# EAGLE design USB-RS232 Adapter (EAGLE 4.14)
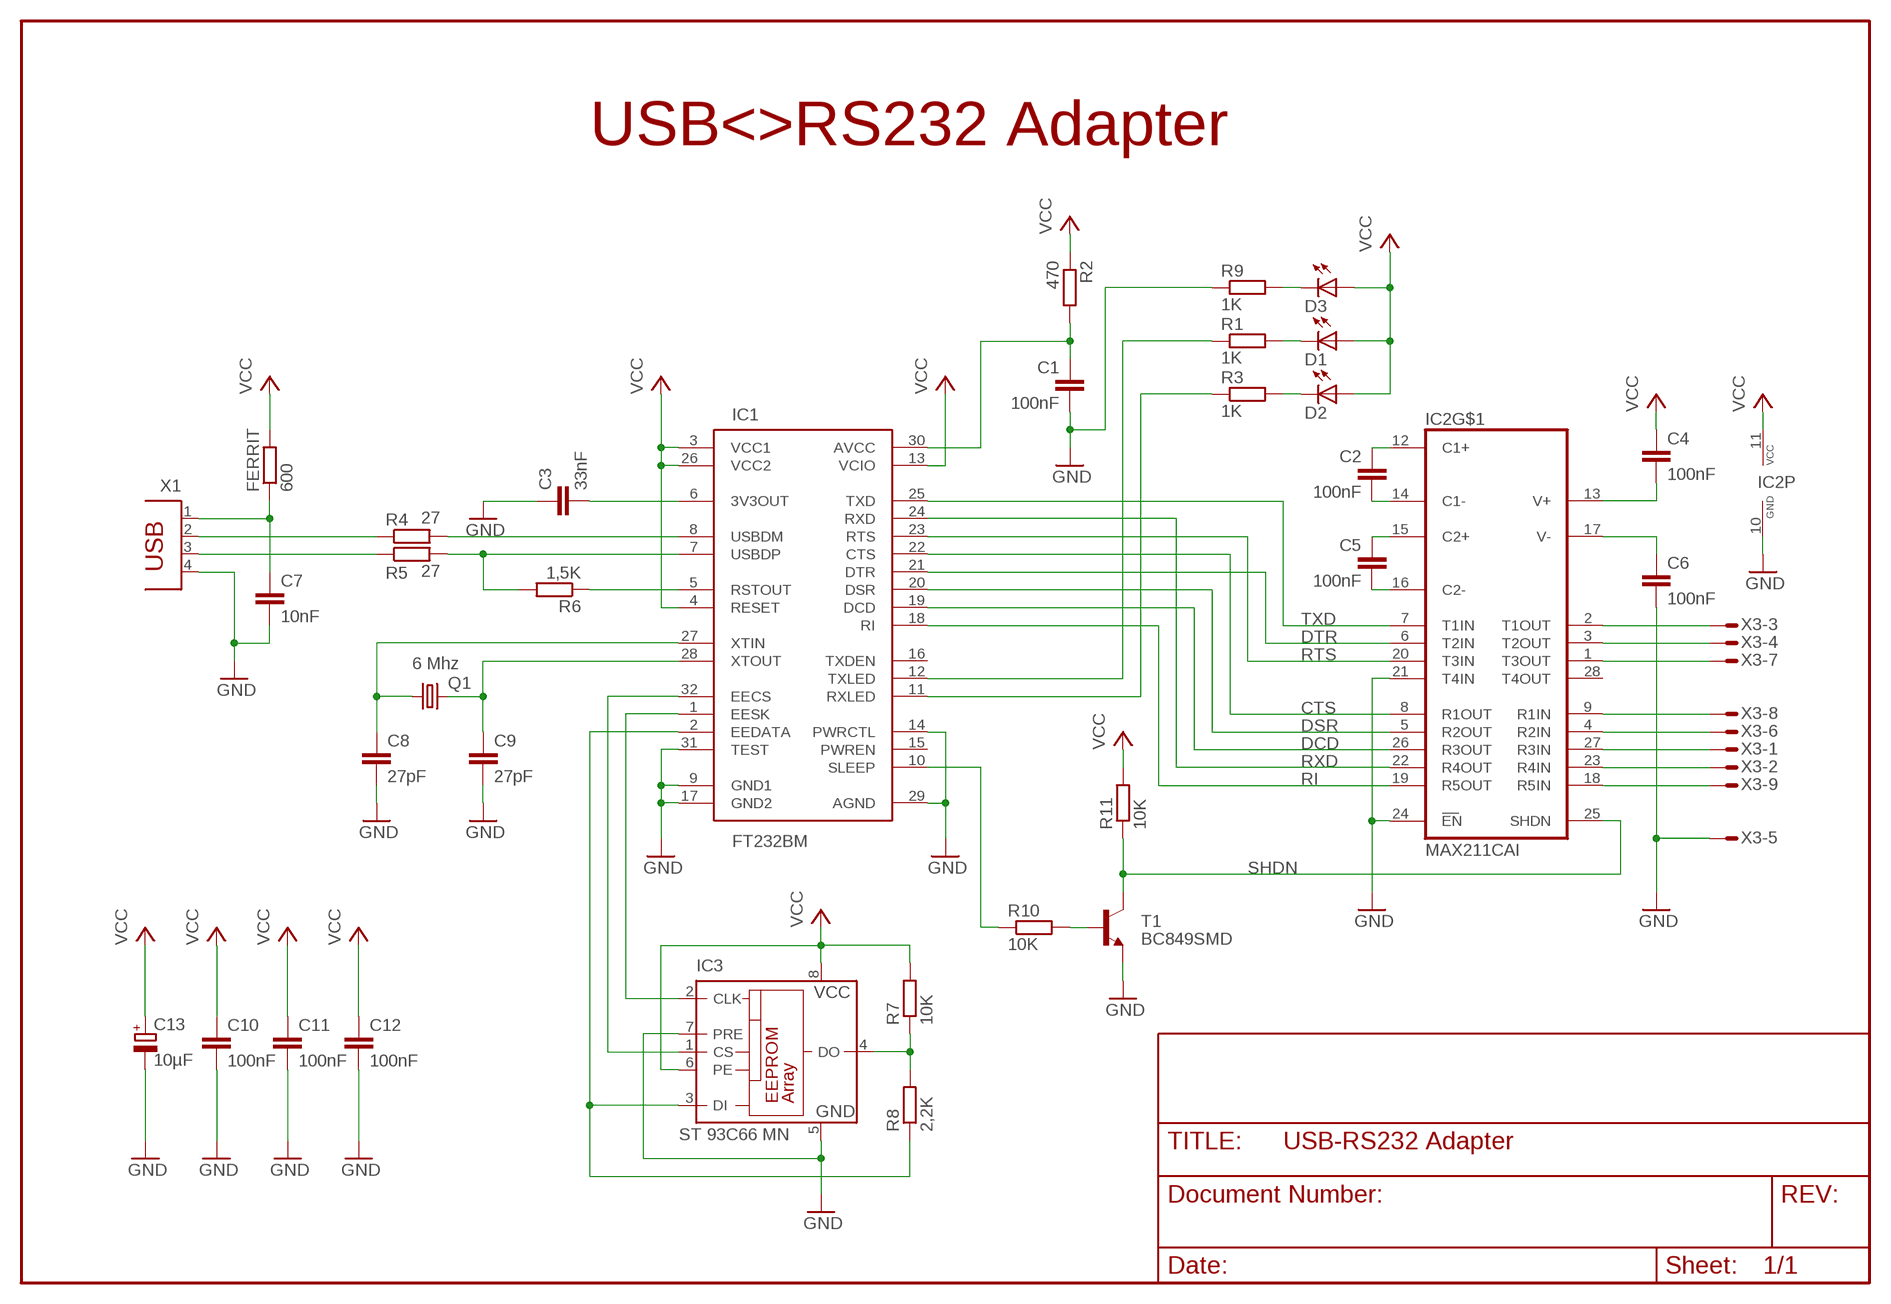
[diagram p0: schematic, sheet 1]

## Parts
C1  100nF  C-EUC1206  [C1206]
C2  100nF  C-EUC1206  [C1206]
C3  33nF  C-EUC1206  [C1206]
C4  100nF  C-EUC1206  [C1206]
C5  100nF  C-EUC1206  [C1206]
C6  100nF  C-EUC1206  [C1206]
C7  10nF  C-EUC1206  [C1206]
C8  27pF  C-EUC1206  [C1206]
C9  27pF  C-EUC1206  [C1206]
C10  100nF  C-EUC1206  [C1206]
C11  100nF  C-EUC1206  [C1206]
C12  100nF  C-EUC1206  [C1206]
C13  10µF  CPOL-EUB  [PANASONIC_B]
D1  LED3MM  [LED3MM]
D2  LED3MM  [LED3MM]
D3  LED3MM  [LED3MM]
FERRIT  600  R-EU_R0805  [R0805]
IC1  FT232BM  [QFP-32]
IC2  MAX211CAI  [SSOP28]
IC3  ST 93C66 MN  93LCS56SN  [SO-08]
Q1  6 Mhz  CRYTALHC49U-V  [HC49U-V]
R1  1K  R-EU_R1206  [R1206]
R2  470  R-EU_R1206  [R1206]
R3  1K  R-EU_R1206  [R1206]
R4  27  R-EU_M1206  [M1206]
R5  27  R-EU_M1206  [M1206]
R6  1,5K  R-EU_R1206  [R1206]
R7  10K  R-EU_R1206  [R1206]
R8  2,2K  R-EU_R1206  [R1206]
R9  1K  R-EU_R1206  [R1206]
R10  10K  R-EU_M1206  [M1206]
R11  10K  R-EU_M1206  [M1206]
T1  BC849SMD  [SOT23-BEC]
X1  PN61729  [PN61729]
X3  M09HPS  [M09HP]

## Nets
_RXD: IC2.23(R4IN) X3.2
_TXD: IC2.2(T1OUT) X3.3
CTS: IC1.22(CTS) IC2.8(R1OUT)
DCD: IC1.19(DCD) IC2.26(R3OUT)
DSR: IC1.20(DSR) IC2.5(R2OUT)
DTR: IC1.21(DTR) IC2.6(T2IN)
EECS: IC1.32(EECS) IC3.1(CS)
EEDATA: IC1.2(EEDATA) IC3.3(DI) R8.1
EESK: IC1.1(EESK) IC3.2(CLK)
GND: C1.2 C3.1 C6.2 C7.2 C8.2 C9.2 C10.2 C11.2 C12.2 C13.- IC1.9(GND1) IC1.14(PWRCTL) IC1.17(GND2) IC1.29(AGND) IC1.31(TEST) IC2.10(P:GND) IC2.21(T4IN) IC2.24(EN) IC3.5(GND) IC3.7(PRE) R9.1 T1.E X1.4 X3.5
N$1: C7.1 FERRIT.1 X1.1
N$3: R4.1 X1.2
N$4: R5.1 X1.3
N$5: IC1.8(USBDM) R4.2
N$6: IC1.7(USBDP) R5.2 R6.2
N$7: IC1.5(RSTOUT) R6.1
N$8: C3.2 IC1.6(3V3OUT)
N$9: C1.1 IC1.30(AVCC) R2.2
N$10: C8.1 IC1.27(XTIN) Q1.1
N$11: IC2.3(T2OUT) X3.4
N$12: D3.K(C) R9.2
N$13: R10.2 T1.B
N$21: IC2.1(T3OUT) X3.7
N$22: IC2.9(R1IN) X3.8
N$23: IC2.4(R2IN) X3.6
N$24: IC2.27(R3IN) X3.1
N$26: IC2.18(R5IN) X3.9
N$27: C4.2 IC2.13(V+)
N$28: C6.1 IC2.17(V-)
N$29: C9.1 IC1.28(XTOUT) Q1.2
N$30: D1.K(C) R1.2
N$31: C2.2 IC2.14(C1-)
N$32: C5.2 IC2.16(C2-)
N$33: C5.1 IC2.15(C2+)
N$34: C2.1 IC2.12(C1+)
N$35: IC3.4(DO) R7.1 R8.2
N$36: D2.K(C) R3.2
RI: IC1.18(RI) IC2.19(R5OUT)
RTS: IC1.23(RTS) IC2.20(T3IN)
RXD: IC1.24(RXD) IC2.22(R4OUT)
RXLED: IC1.11(RXLED) R3.1
SHDN: IC2.25(SHDN) R11.1 T1.C
SLEEP: IC1.10(SLEEP) R10.1
TXD: IC1.25(TXD) IC2.7(T1IN)
TXLED: IC1.12(TXLED) R1.1
VCC: C4.1 C10.1 C11.1 C12.1 C13.+ D1.A D2.A D3.A FERRIT.2 IC1.3(VCC1) IC1.4(RESET) IC1.13(VCIO) IC1.26(VCC2) IC2.11(P:VCC) IC3.6(PE) IC3.8(VCC) R2.1 R7.2 R11.2
Unconnected: IC1.15(PWREN) IC1.16(TXDEN) IC2.28(T4OUT)

## Notes on the sheet
- USB<>RS232 Adapter

## Library data of the parts
C1-C12 = rcl:C-EU: CAPACITOR, European symbol
C13 = rcl:CPOL-EU: POLARIZED CAPACITOR, European symbol
D1-D3 = led:LED: LED OSRAM: - CHIPLED LG R971, LG N971, LY N971, LG Q971, LY Q971, LO R971, LY R971 LH N974, LH R974 LS Q976, LO Q976, LY Q976 LO Q996 - Hyper CHIPLED LW Q18S LB Q993, LB Q99A, LB R99A - SideLED LS A670, LO A670, LY A670, LG A670, LP A670 LB A673, LV A673, LT A673, LW A673 LH A674 LY A675 LS A676, LA A676, LO A676, LY A676, LW A676 LS A679, LY A679, LG A679 - Hyper Micro SIDELED® LS Y876, LA Y876, LO Y876, LY Y876 LT Y87S - SmartLED LW L88C, LW L88S LB L89C, LB L89S, LG L890 LS L89K, LO L89K, LY L89K LS L896, LA L896, LO L896, LY L896 - TOPLED LS T670, LO T670, LY T670, LG T670, LP T670 LSG T670, LSP T670, LSY T670, LOP T670, LYG T670 LG T671, LOG T671, LSG T671 LB T673, LV T673, LT T673, LW T673 LH T674 LS T676, LA T676, LO T676, LY T676, LB T676, LH T676, LSB T676, LW T676 LB T67C, LV T67C, LT T67C, LS T67K, LO T67K, LY T67K, LW E67C LS E67B, LA E67B, LO E67B, LY E67B, LB E67C, LV E67C, LT E67C LW T67C LS T679, LY T679, LG T679 LS T770, LO T770, LY T770, LG T770, LP T770 LB T773, LV T773, LT T773, LW T773 LH T774 LS E675, LA E675, LY E675, LS T675 LS T776, LA T776, LO T776, LY T776, LB T776 LHGB T686 LT T68C, LB T68C - Hyper Mini TOPLED® LB M676 - Mini TOPLED Santana® LG M470 LS M47K, LO M47K, LY M47K Source: http://www.osram.convergy.de/
FERRIT R1-R11 = rcl:R-EU_: RESISTOR, European symbol
IC1 = ftdi:FT232BM: FT232BM USB-RS232 Wandler FTDI
IC2 = maxim:MAX211: RS232 Transciever 0.1 µF externe Kondensatoren
IC3 = microchip:93LCS*: EEPROM 2 K/4 K, 2.5 V Microwire with software write protect
Q1 = crystal:CRYTAL: CRYSTAL
T1 = transistor-npn:BC849*: NPN Transistor
X1 = con-berg:PN61729: BERG
X3 = con-subd:M09?S: SUB-D

## Board
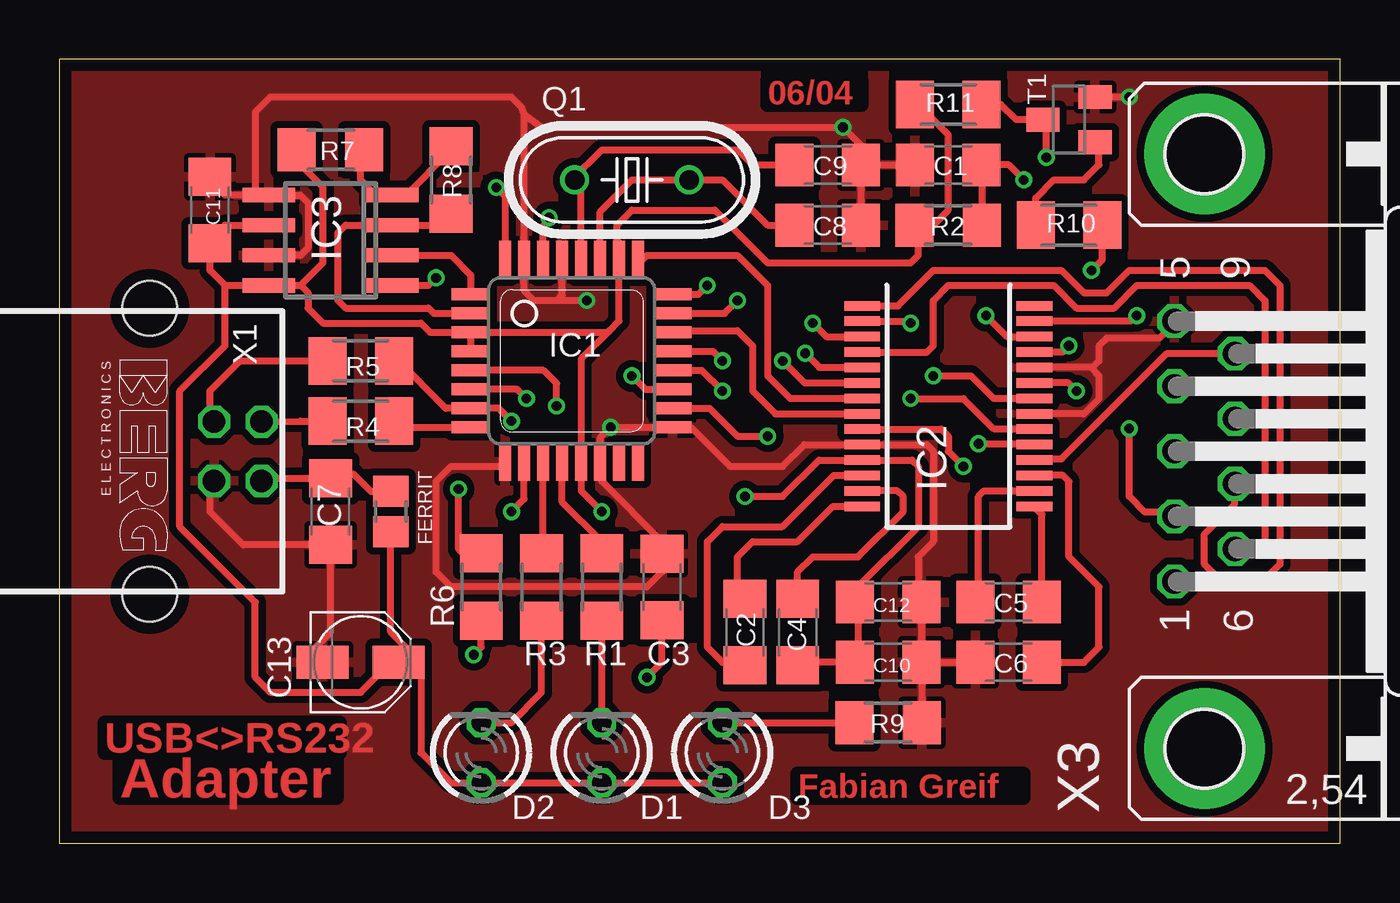
[diagram p1: board, top side]
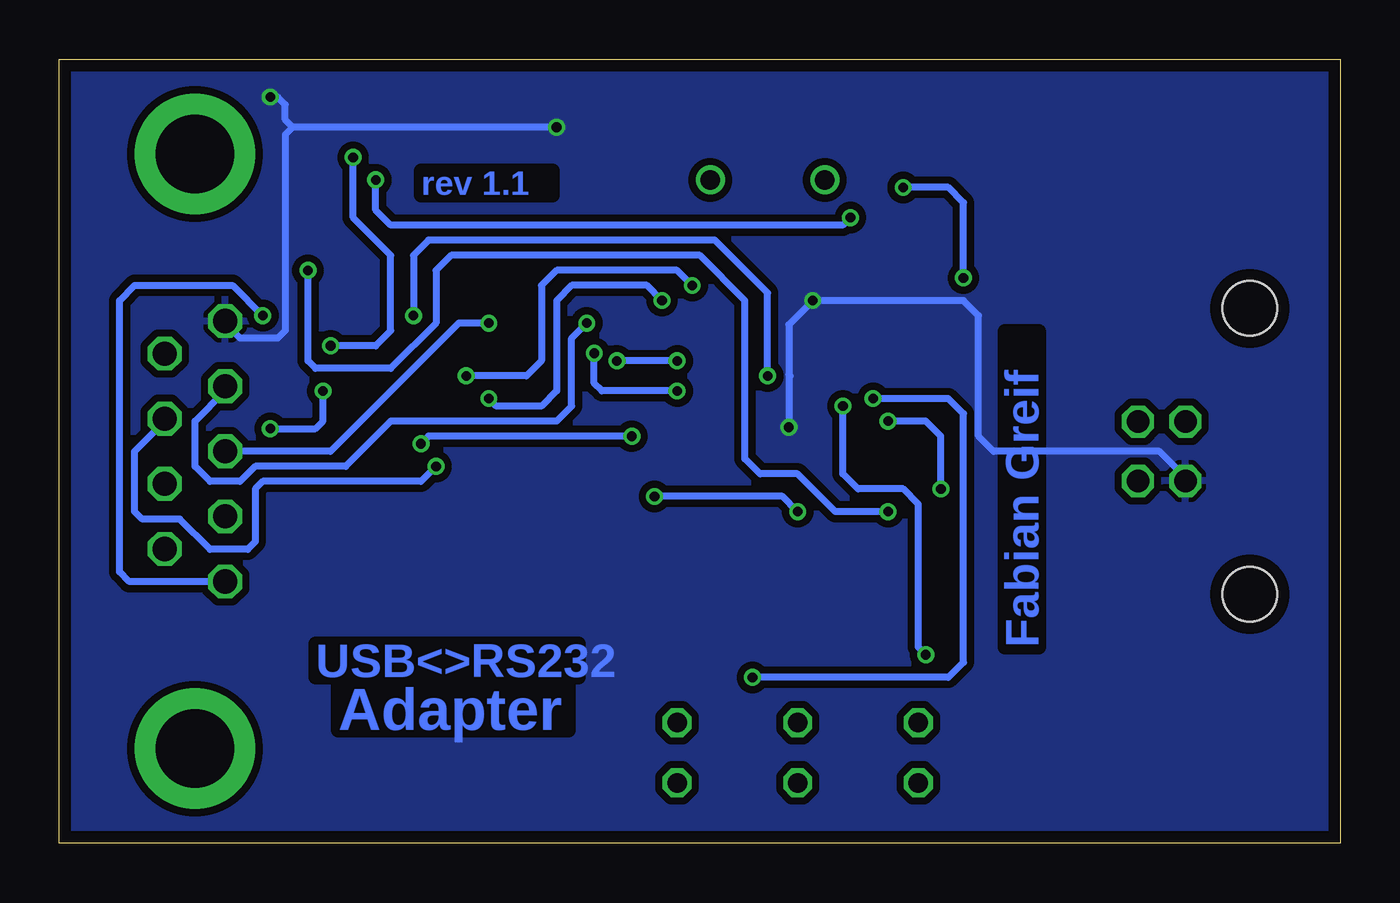
[diagram p2: board, bottom side, seen from below]

Size 53.98 x 33.02 mm. Coordinates in mm from the lower left corner, seen from the top.
Outline: 0,0 53.98,0 53.98,33.02 0,33.02 0,0
Copper layers (1*16): Top 0.035mm / dielectric 1.5mm / Bottom 0.035mm
Design rules "PCB-POOL": minimum track width 6mil, minimum drill 12mil, track to track 6mil, track to pad 6mil, pad to pad 6mil, via to via 6mil, smd to smd 6mil, copper to edge 20mil, drill to drill 8mil, minimum pad ring 8mil, minimum via ring 6mil, stop-mask expansion 3mil, vias tented up to drill 0mil, thermal gap 8mil

### Footprints (pad centres in the part's own frame; a part is rotated, then mirrored left to right if it is on the bottom)
C1206 = smd 1.6 x 1.8: 1 -1.4,0; 2 1.4,0
PANASONIC_B = smd 2.2 x 1.4: + 1.6,0; - -1.6,0
LED3MM = drill 0.813 octagon: A -1.27,0; K 1.27,0
R0805 = smd 1.3 x 1.5: 1 -0.85,0; 2 0.85,0
QFP-32 = smd 0.508 x 1.6: 1 -2.8,-4.25; 2 -2,-4.25; 3 -1.2,-4.25; 4 -0.4,-4.25; 5 0.4,-4.25; 6 1.2,-4.25; 7 2,-4.25; 8 2.8,-4.25; 17 2.8,4.25; 18 2,4.25; 19 1.2,4.25; 20 0.4,4.25; 21 -0.4,4.25; 22 -1.2,4.25; 23 -2,4.25; 24 -2.8,4.25 | smd 1.6 x 0.508: 9 4.25,-2.8; 10 4.25,-2; 11 4.25,-1.2; 12 4.25,-0.4; 13 4.25,0.4; 14 4.25,1.2; 15 4.25,2; 16 4.25,2.8; 25 -4.25,2.8; 26 -4.25,2; 27 -4.25,1.2; 28 -4.25,0.4; 29 -4.25,-0.4; 30 -4.25,-1.2; 31 -4.25,-2; 32 -4.25,-2.8
SSOP28 = smd 0.4 x 1.5: 1 -4.225,-3.625; 2 -3.575,-3.625; 3 -2.925,-3.625; 4 -2.275,-3.625; 5 -1.625,-3.625; 6 -0.975,-3.625; 7 -0.325,-3.625; 8 0.325,-3.625; 9 0.975,-3.625; 10 1.625,-3.625; 11 2.275,-3.625; 12 2.925,-3.625; 13 3.575,-3.625; 14 4.225,-3.625; 15 4.225,3.625; 16 3.575,3.625; 17 2.925,3.625; 18 2.275,3.625; 19 1.625,3.625; 20 0.975,3.625; 21 0.325,3.625; 22 -0.325,3.625; 23 -0.975,3.625; 24 -1.625,3.625; 25 -2.275,3.625; 26 -2.925,3.625; 27 -3.575,3.625; 28 -4.225,3.625
SO-08 = smd 0.6 x 2.2: 1 -1.905,-2.6; 2 -0.635,-2.6; 3 0.635,-2.6; 4 1.905,-2.6; 5 1.905,2.6; 6 0.635,2.6; 7 -0.635,2.6; 8 -1.905,2.6
HC49U-V = drill 0.813 round: 1 -2.413,0; 2 2.413,0
R1206 = smd 1.6 x 1.803: 1 -1.422,0; 2 1.422,0
M1206 = smd 1.6 x 2: 1 -1.4,0; 2 1.4,0
SOT23-BEC = smd 1 x 1.4: B -0.95,-1.1; C 0,1.1; E 0.95,-1.1
PN61729 = drill 0.95 octagon: 1 1.25,4.71; 2 -1.25,4.71; 3 -1.25,2.71; 4 1.25,2.71 | hole 2.3: -6.02,0; 6.02,0
M09HP = drill 1.016 octagon: 1 -5.486,1.27; 2 -2.743,1.27; 3 0,1.27; 4 2.743,1.27; 5 5.486,1.27; 6 -4.115,-1.27; 7 -1.372,-1.27; 8 1.372,-1.27; 9 4.115,-1.27 | drill 3.302 pad 5.08 round: G1 -12.522,0; G2 12.522,0

### Placement (x,y rotation side)
C1  37.47,28.57 180 top
C2  28.89,8.89 90 top
C3  25.4,10.79 270 top
C4  31.11,8.89 90 top
C5  40.01,10.16 180 top
C6  40.01,7.62 180 top
C7  11.43,13.97 270 top
C8  32.38,26.04 0 top
C9  32.38,28.57 0 top
C10  34.92,7.62 0 top
C11  6.35,26.67 90 top
C12  34.92,10.16 0 top
C13  12.7,7.62 0 top
D1  22.86,3.81 90 top
D2  17.78,3.81 90 top
D3  27.94,3.81 90 top
FERRIT  13.97,13.97 270 top
IC1  21.59,20.32 270 top
IC2  37.47,18.41 270 top
IC3  11.43,25.4 90 top
Q1  24.13,27.94 180 top
R1  22.86,10.79 270 top
R2  37.47,26.04 0 top
R3  20.32,10.79 270 top
R4  12.7,17.78 0 top
R5  12.7,20.32 0 top
R6  17.78,10.79 90 top
R7  11.43,29.21 180 top
R8  16.51,27.94 90 top
R9  34.92,5.08 180 top
R10  42.55,26.04 180 top
R11  37.47,31.11 180 top
T1  42.55,30.48 90 top
X1  3.81,16.51 270 top
X3  48.26,16.51 90 top

### Tracks (layer width: path | path; a pad name or v marks a point on that pad's centre or on a via)
_RXD  (via drill 0.41)
  Top 0.305: IC2.23 42.52,19.39 v42.86,19.05 | v45.09,17.46 45.09,14.61 45.72,13.97 46.99,13.97 X3.2
  Bottom 0.305: v42.86,19.05 42.86,17.78 43.18,17.46 v45.09,17.46
_TXD  (via drill 0.41)
  Top 0.305: IC2.2 35.8,21.99 v35.88,21.91
  Bottom 0.305: v35.88,21.91 37.15,21.91 42.55,16.51 X3.3
CTS
  Top 0.305: IC1.22 25.96,21.52 26.04,21.59 28.57,21.59 29.21,20.95 29.21,19.05 30.17,18.09 IC2.8
DCD  (via drill 0.41)
  Top 0.305: IC1.19 24.7,19.12 v24.13,19.68 | IC2.26 39.94,21.34 v39.05,22.23
  Bottom 0.305: v24.13,19.68 24.13,23.18 26.35,25.4 38.42,25.4 39.05,24.77 v39.05,22.23
DSR  (via drill 0.41)
  Top 0.305: IC1.20 27.07,19.92 v27.94,19.05 | IC2.5 32.03,20.04 v31.43,20.64
  Bottom 0.305: v27.94,19.05 31.11,19.05 31.43,19.37 v31.43,20.64
DTR  (via drill 0.41)
  Top 0.305: IC1.21 27.54,20.72 v27.94,20.32 | IC2.6 31.41,19.39 v30.48,20.32
  Bottom 0.305: v27.94,20.32 v30.48,20.32
EECS  (via drill 0.41)
  Top 0.305: v15.88,23.81 15.56,23.5 IC3.1 | v18.41,27.62 18.79,27.25 IC1.32
  Bottom 0.305: v18.41,27.62 16.51,27.62 15.88,26.99 v15.88,23.81
EEDATA
  Top 0.305: R8.1 16.51,26.67 15.88,26.04 IC3.3 12.06,26.04 11.75,25.72 11.75,22.86 12.06,22.54 15.56,22.54 15.78,22.32 IC1.2
EESK
  Top 0.305: IC3.2 16.51,24.77 17.34,23.93 IC1.1
GND  (via drill 0.41)
  Top 0.305: C7.2 7.75,12.57 6.35,13.97 6.35,15.24 6.37,15.26 X1.4 | C7.2 11.43,8.89 10.16,7.62 C13.- | 8.26,27.3 6.99,27.3 6.35,27.94 C11.2 | IC1.29 21.19,23.09 20.95,22.86 | 20.95,22.86 20,22.86 19.59,23.27 IC1.31 19.59,30.7 | 25.4,17.52 v23.23,17.52 22.79,17.07 IC1.14 22.79,15.95 22.86,15.88 22.86,15.24 25.4,12.7 C3.1 25.4,11.43 24.77,10.79 16.51,10.79 15.88,11.43 15.88,15.24 16.51,15.88 18.73,15.88 | 25.4,17.52 IC1.17 | v22.23,22.86 20.95,22.86 | C7.2 11.43,12.7 | 8.26,27.3 8.26,30.8 8.89,31.43 19.05,31.43 19.46,31.02 19.59,30.7 | 25.4,17.52 26.61,17.52 28.26,15.88 30.48,15.88 31.39,16.79 IC2.10 36.55,16.79 36.83,16.51 36.83,12.7 36.2,12.06 36.2,10.16 | IC3.7 10.16,24.77 10.48,25.08 10.48,26.99 10.16,27.3 IC3.5 8.26,27.3 | 36.2,10.16 C12.2 | 38.73,7.62 C6.2 C10.2 | 33.66,28.57 C9.2 33.78,29.4 v33.02,30.16 20.32,30.16 19.59,30.7 | C8.2 33.78,28.45 33.66,28.57 | 33.66,28.57 C1.2 | C10.2 36.2,7.62 36.35,7.47 R9.1 | 18.73,15.88 18.79,15.88 | IC1.9 18.79,15.93 18.73,15.88 | IC2.21 43.17,18.09 43.81,18.73 43.81,19.68 43.46,20.04 | 43.46,20.04 IC2.24 | 43.46,20.04 43.53,20.04 43.81,20.32 43.81,20.95 44.13,21.27 46.35,21.27 46.99,21.91 X3.5 46.99,22.23 | C10.2 36.33,10.03 36.2,10.16 | v45.09,31.43 43.5,31.43 T1.E
  Bottom 0.305: 23.23,21.85 v23.23,17.52 | 23.23,21.85 v22.23,22.86 15.88,22.86 15.24,22.23 15.24,17.14 14.61,16.51 7.62,16.51 6.52,15.41 X1.4 | 23.23,21.85 23.23,19.74 23.18,19.68 | 44.13,30.16 44.45,30.48 44.45,31.11 44.77,31.43 v45.09,31.43 | X3.5 46.99,21.91 46.35,21.27 44.77,21.27 44.45,21.59 44.45,29.84 44.13,30.16 | v33.02,30.16 44.13,30.16
  pour Bottom (isolate 0.305): -1.27,34.29 55.24,34.29 55.24,-1.27 -1.27,-1.27
  pour Top (isolate 0.305): -0.64,33.66 54.61,33.66 54.61,-0.64 -0.64,-0.64
N$1
  Top 0.305: X1.1 8.55,15.26 8.57,15.24 8.7,15.37 C7.1 11.43,15.24 11.58,15.39 12.38,15.56 13.12,14.82 FERRIT.1
N$3
  Top 0.305: X1.2 8.55,17.76 10.16,17.78 R4.1
N$4
  Top 0.305: X1.3 6.37,17.76 6.35,17.78 6.35,19.05 7.62,20.32 R5.1 11.43,20.32
N$5
  Top 0.305: R4.2 13.97,17.78 14.23,17.52 IC1.8
N$6  (via drill 0.41)
  Top 0.305: R5.2 14.29,20.32 16.29,18.32 IC1.7 18.51,18.32 v19.05,17.78 | R6.2 17.14,12.06 16.83,12.38 v16.83,14.92
  Bottom 0.305: v19.05,17.78 17.46,17.78 16.83,17.14 v16.83,14.92
N$7  (via drill 0.41)
  Top 0.305: IC1.5 20.4,19.92 20.95,19.37 v20.95,18.41 | R6.1 17.78,8.26 v17.46,7.94
  Bottom 0.305: v17.46,7.94 17.78,8.26 17.78,14.29 18.41,14.92 20.32,14.92 20.95,15.56 v20.95,18.41
N$8  (via drill 0.41)
  Top 0.305: IC1.6 19.3,19.12 v19.68,18.73 | v24.77,6.99 25.4,7.62 C3.2 25.4,9.53
  Bottom 0.305: v19.68,18.73 16.51,18.73 15.88,18.1 15.88,7.62 16.51,6.99 v24.77,6.99
N$9  (via drill 0.41)
  Top 0.305: IC1.30 20.39,25.96 v20.64,26.35 | 38.73,26.04 R2.2 38.89,28.42 38.73,28.57 | 38.73,28.57 C1.1 | 38.73,28.57 40.01,28.57 v40.64,27.94
  Bottom 0.305: v20.64,26.35 20.95,26.04 40.01,26.04 40.64,26.67 v40.64,27.94
N$10
  Top 0.305: IC1.27 22.79,26.6 24.13,27.94 Q1.1 27.94,27.94 29.84,26.04 C8.1
N$11  (via drill 0.41)
  Top 0.305: IC2.3 32.32,21.34 v31.75,21.91
  Bottom 0.305: v31.75,21.91 32.38,21.27 32.38,18.41 33.02,17.78 40.01,17.78 41.91,15.88 45.72,15.88 46.35,15.24 47.62,15.24 48.26,15.88 48.26,17.78 46.99,19.05 X3.4
N$12
  Top 0.305: D3.K R9.2
N$13
  Top 0.305: R10.2 41.15,27.18 41.91,27.94 43.18,27.94 43.81,28.57 43.81,29.21 43.65,29.38 T1.B
N$21
  Top 0.305: IC2.1 35.34,22.64 36.83,24.13 42.23,24.13 43.18,23.18 44.13,23.18 45.09,24.13 50.8,24.13 51.44,23.5 51.44,11.75 50.8,11.11 48.9,11.11 48.26,11.75 48.26,13.02 49.53,14.29 X3.7 49.53,15.24
N$22  (via drill 0.41)
  Top 0.305: IC2.9 37.17,17.44 37.47,17.14 37.47,16.51 v38.1,15.88
  Bottom 0.305: v38.1,15.88 38.73,15.24 45.4,15.24 45.72,14.92 45.72,12.7 46.04,12.38 47.62,12.38 48.9,13.65 50.48,13.65 50.8,13.97 50.8,16.51 49.53,17.78 X3.8
N$23
  Top 0.305: IC2.4 36.56,20.69 36.83,20.95 36.83,22.86 37.47,23.5 41.91,23.5 42.86,22.54 44.45,22.54 45.4,23.5 50.16,23.5 50.8,22.86 50.8,12.7 50.49,12.39 X3.6
N$24  (via drill 0.41)
  Top 0.305: IC2.27 45.17,21.99 v45.4,22.23
  Bottom 0.305: v45.4,22.23 46.67,23.5 50.8,23.5 51.44,22.86 51.44,11.43 51.03,11.02 X3.1
N$26
  Top 0.305: IC2.18 41.22,16.14 41.27,16.19 42.23,16.19 46.67,20.64 49.21,20.64 49.53,20.32 X3.9
N$27
  Top 0.305: IC2.13 35.33,14.84 35.56,14.61 35.56,13.97 33.66,12.06 31.75,12.06 31.11,11.43 C4.2
N$28
  Top 0.305: IC2.17 42.3,15.49 42.55,15.24 42.55,12.06 43.81,10.79 43.81,8.26 43.18,7.62 C6.1 41.27,7.62
N$29
  Top 0.305: IC1.28 21.99,27.54 21.72,27.81 Q1.2 21.59,27.94 22.86,29.21 28.57,29.21 29.21,28.57 C9.1 31.11,28.57
N$30
  Top 0.305: D1.K R1.2
N$31
  Top 0.305: IC2.14 32.6,14.19 31.11,12.7 29.21,12.7 28.57,12.06 28.57,10.79 29.08,10.29 | 29.08,10.29 29.21,10.16 | C2.2 29.08,10.29
N$32
  Top 0.305: IC2.16 38.97,14.84 38.73,14.61 38.73,10.16 C5.2
N$33
  Top 0.305: IC2.15 41.09,14.15 41.41,13.84 C5.1
N$34
  Top 0.305: IC2.12 32.63,15.49 30.48,13.34 27.94,13.34 27.3,12.7 27.3,8.26 27.94,7.62 28.57,7.62 28.7,7.49 C2.1
N$35
  Top 0.305: R7.1 12.7,29.21 12.7,27.94 13.34,27.3 IC3.4 14.61,27.3 16.51,29.21 R8.2
N$36
  Top 0.305: R3.2 20.32,6.35 19.05,5.08 D2.K
RI  (via drill 0.41)
  Top 0.305: IC1.18 27.4,18.32 28.57,17.14 v29.84,17.14 | IC2.19 40.99,16.79 40.96,16.83 v38.73,16.83
  Bottom 0.305: v29.84,17.14 38.42,17.14 v38.73,16.83
RTS  (via drill 0.41)
  Top 0.305: IC1.23 28.04,22.32 v28.57,22.86 | IC2.20 40.98,17.44 40.96,17.46 39.37,17.46 38.1,18.73 v35.88,18.73
  Bottom 0.305: v28.57,22.86 29.21,23.5 32.38,23.5 33.02,22.86 33.02,19.05 33.66,18.41 35.56,18.41 v35.88,18.73
RXD  (via drill 0.41)
  Top 0.305: IC1.24 26.93,23.12 v27.3,23.5 | IC2.22 39.36,18.74 38.42,19.68 v36.83,19.68
  Bottom 0.305: v27.3,23.5 27.94,24.13 33.02,24.13 33.66,23.5 33.66,20.32 34.29,19.68 v36.83,19.68
RXLED
  Top 0.305: R3.1 20.32,12.06 20.39,12.13 IC1.11
SHDN  (via drill 0.41)
  Top 0.305: IC2.25 42.28,20.69 v42.55,20.95 | R11.1 39.69,31.11 40.32,30.48 41.27,30.48 | 41.27,30.48 T1.C | v41.59,28.89 41.59,30.16 41.27,30.48
  Bottom 0.305: v42.55,20.95 40.64,20.95 40.01,21.59 40.01,24.77 41.59,26.35 v41.59,28.89
SLEEP  (via drill 0.41)
  Top 0.305: IC1.10 19.59,14.51 v19.05,13.97 | R10.1 43.95,24.58 v43.5,24.13
  Bottom 0.305: v19.05,13.97 21.27,13.97 22.86,15.56 24.45,15.56 25.08,16.19 25.08,22.86 26.99,24.77 37.47,24.77 38.1,24.13 38.1,21.91 40.01,20 43.18,20 43.5,20.32 v43.5,24.13
TXD
  Top 0.305: IC1.25 24.57,24.57 24.77,24.77 28.57,24.77 29.84,23.5 29.84,19.68 30.79,18.74 IC2.7
TXLED
  Top 0.305: R1.1 22.86,12.7 21.19,14.37 IC1.12
VCC  (via drill 0.41)
  Top 0.305: FERRIT.2 13.97,8.89 15.24,7.62 | 10.16,23.5 11.11,24.45 11.11,27.62 10.16,28.57 10.16,29.21 R7.2 | 15.24,7.62 15.24,3.81 16.51,2.54 D2.A D1.A D3.A | 23.18,21.59 23.11,21.52 IC1.3 17.14,21.52 | 23.18,21.59 23.59,22 IC1.26 23.59,25.3 23.5,25.4 | 17.14,21.52 15.63,21.52 15.24,21.91 11.11,21.91 10.48,22.54 10.48,23.18 10.16,23.5 | 23.18,21.59 21.99,20.4 IC1.13 21.99,14.84 v22.86,13.97 | 15.24,7.62 C13.+ 13.97,7.62 12.7,6.35 8.89,6.35 8.26,6.99 8.26,10.16 5.08,13.34 5.08,19.05 6.99,20.95 6.99,23.5 | 6.99,23.5 6.35,24.13 C11.1 6.35,25.4 6.99,26.04 IC3.6 | 6.99,23.5 IC3.8 10.16,23.5 | 17.14,21.52 17.14,21.59 17.34,21.39 IC1.4 | v28.89,14.61 30.48,14.61 32.02,16.14 IC2.11 35.93,16.14 36.2,15.88 36.2,13.34 33.66,10.79 33.66,10.16 | 36.2,26.04 36.83,26.04 37.47,26.67 37.47,29.84 36.2,31.11 R11.2 | 36.2,26.04 R2.1 | 23.5,25.4 23.5,24.77 | 23.5,25.4 23.5,26.04 24.13,26.67 27.62,26.67 29.84,24.45 35.88,24.45 36.2,24.77 36.2,26.04 | 33.66,10.16 C12.1 | 33.66,10.16 33.66,7.62 | 33.66,7.62 C10.1 | C4.1 31.11,7.62 33.66,7.62
  Bottom 0.305: v28.89,14.61 23.5,14.61 v22.86,13.97

### Text on the board
Top: 06/04 | USB<>RS232 | Adapter | Fabian Greif
Bottom: rev 1.1 | Fabian Greif | USB<>RS232 | Adapter
Measures: 54 mm | 33 mm